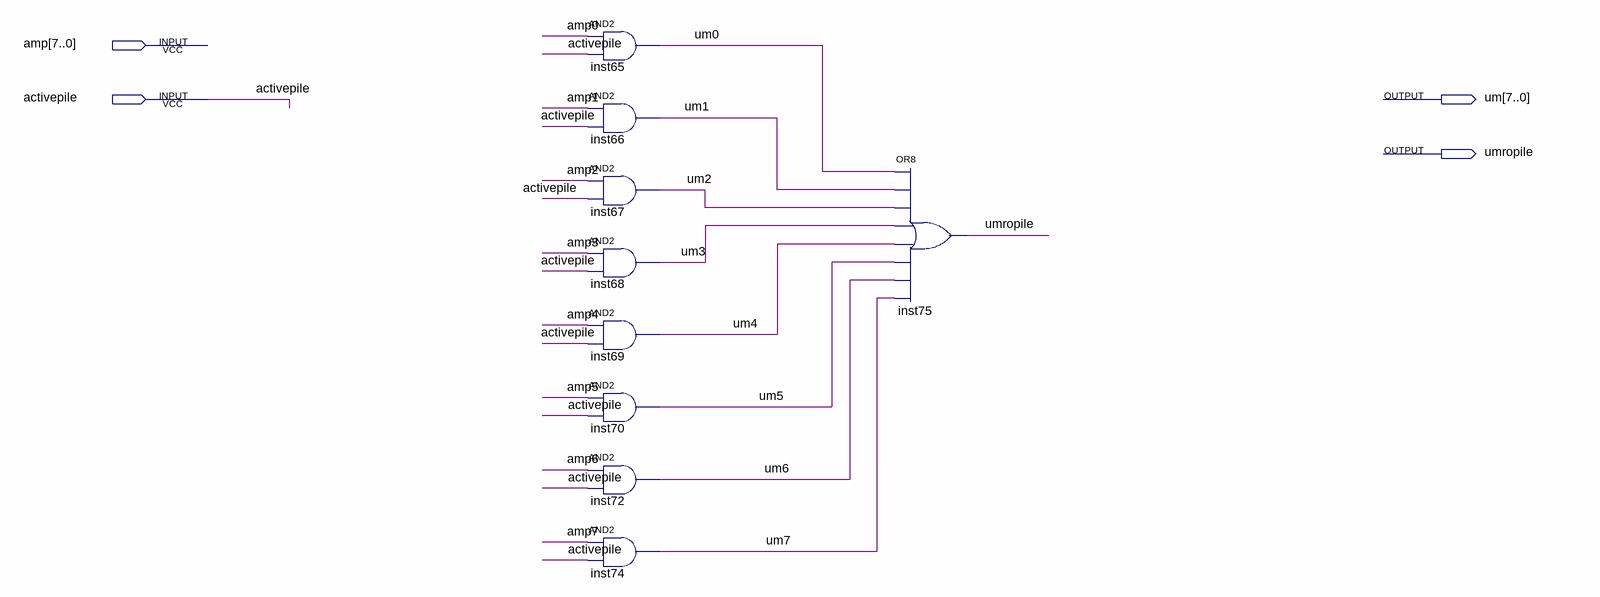
[diagram p0: schematic sheet]
// Quartus schematic detekcijaSudara.bdf as structural Verilog: 9 symbols, 4 pins
module detekcijaSudara (
  input  [7:0] amp,
  input  activepile,
  output [7:0] um,
  output umropile
);

  and inst65 (um[0], amp[0], activepile);
  and inst66 (um[1], amp[1], activepile);
  and inst67 (um[2], amp[2], activepile);
  and inst68 (um[3], amp[3], activepile);
  and inst69 (um[4], amp[4], activepile);
  and inst70 (um[5], amp[5], activepile);
  and inst72 (um[6], amp[6], activepile);
  and inst74 (um[7], amp[7], activepile);
  or inst75 (umropile, um[0], um[1], um[2], um[3], um[4], um[5], um[6], um[7]);
endmodule
